# Altium schematic sheet hades_flight_controller_schematic.SchDoc (part 1 of 2)
size A1
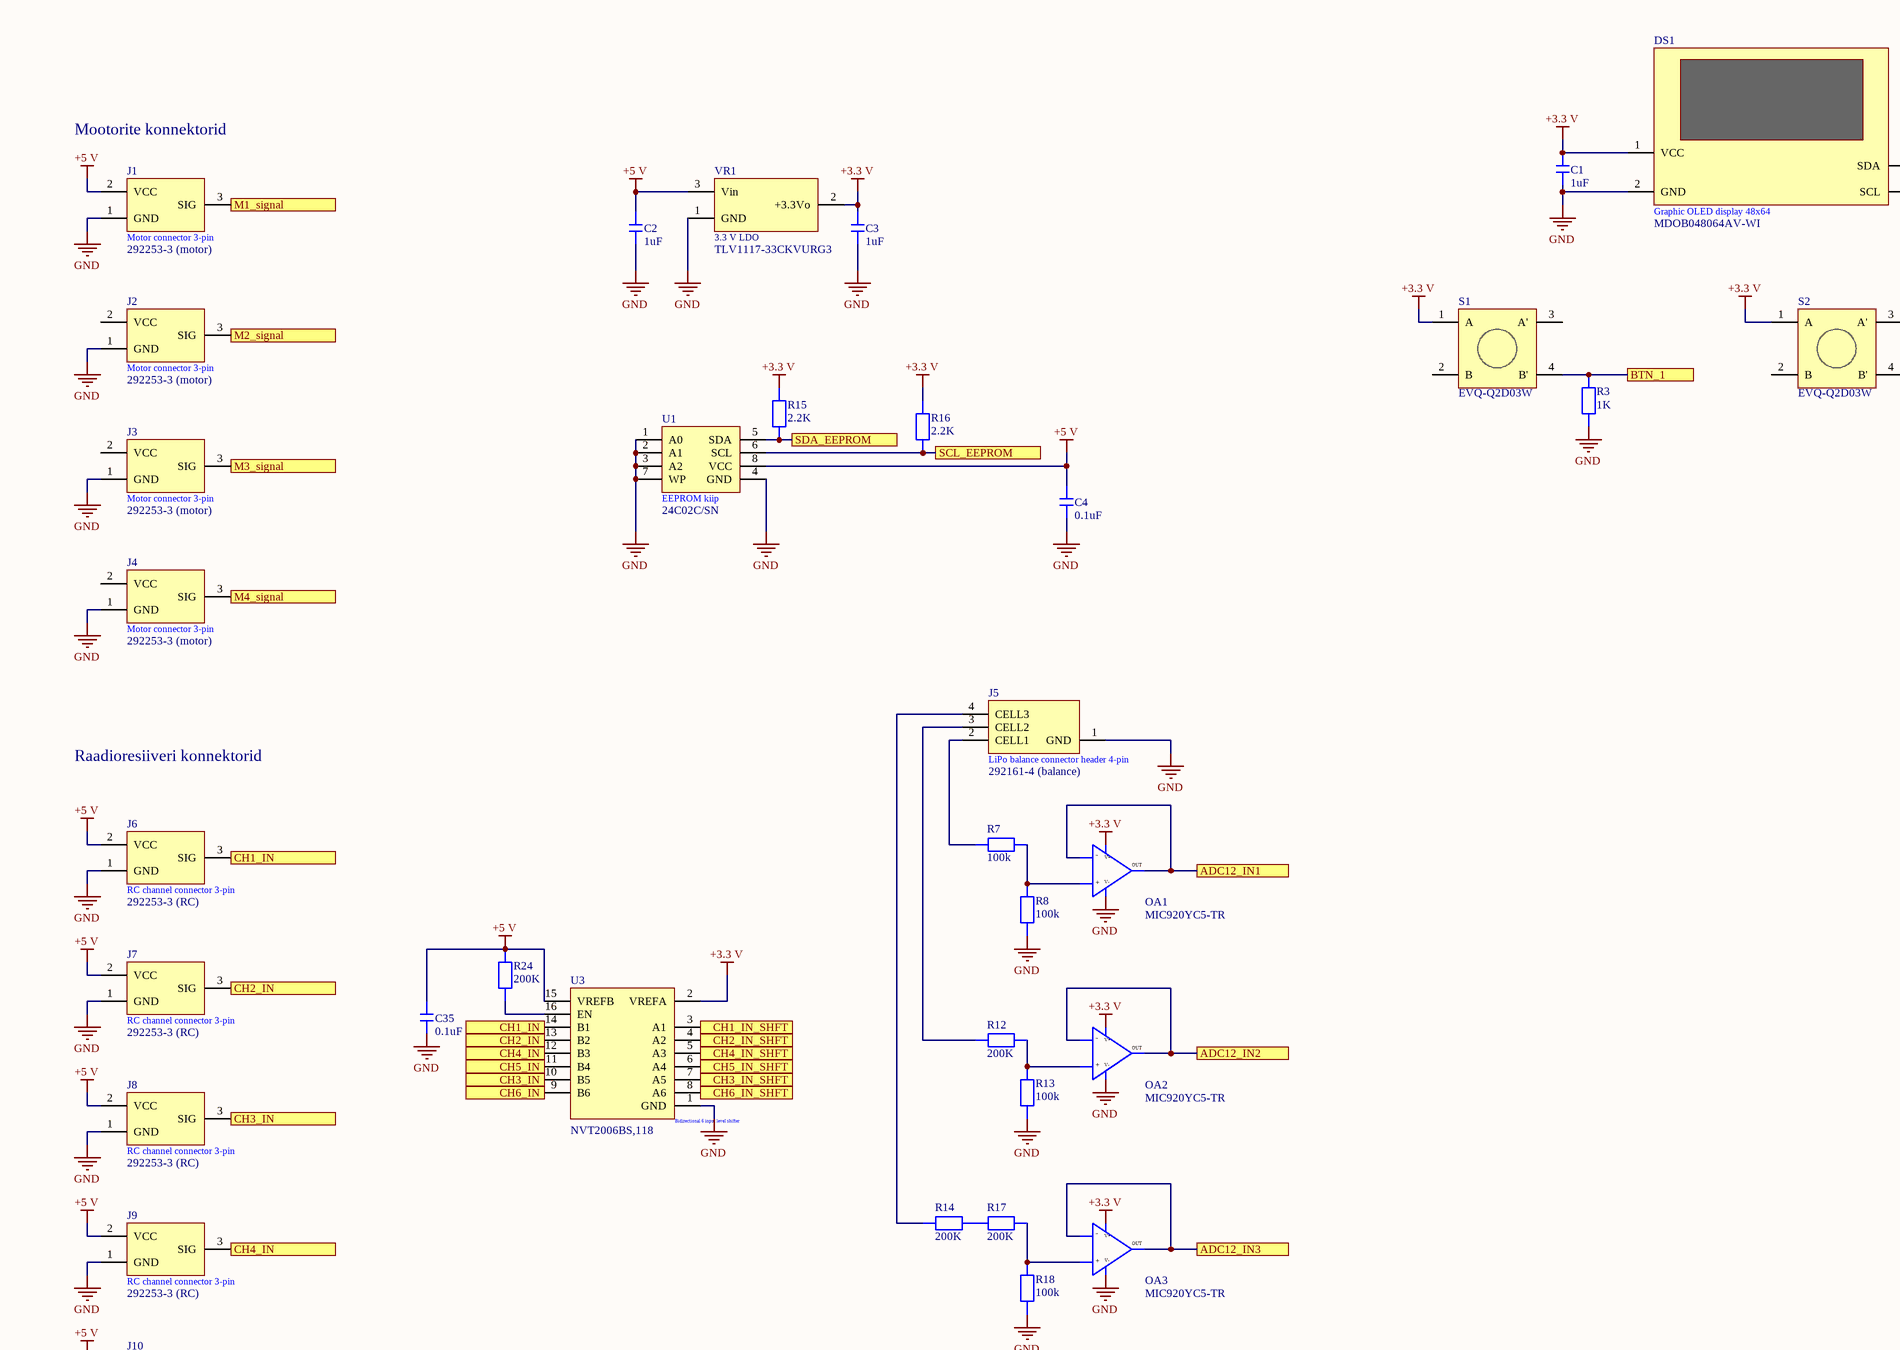
[diagram p0: hades_flight_controller_schematic.SchDoc, top left]
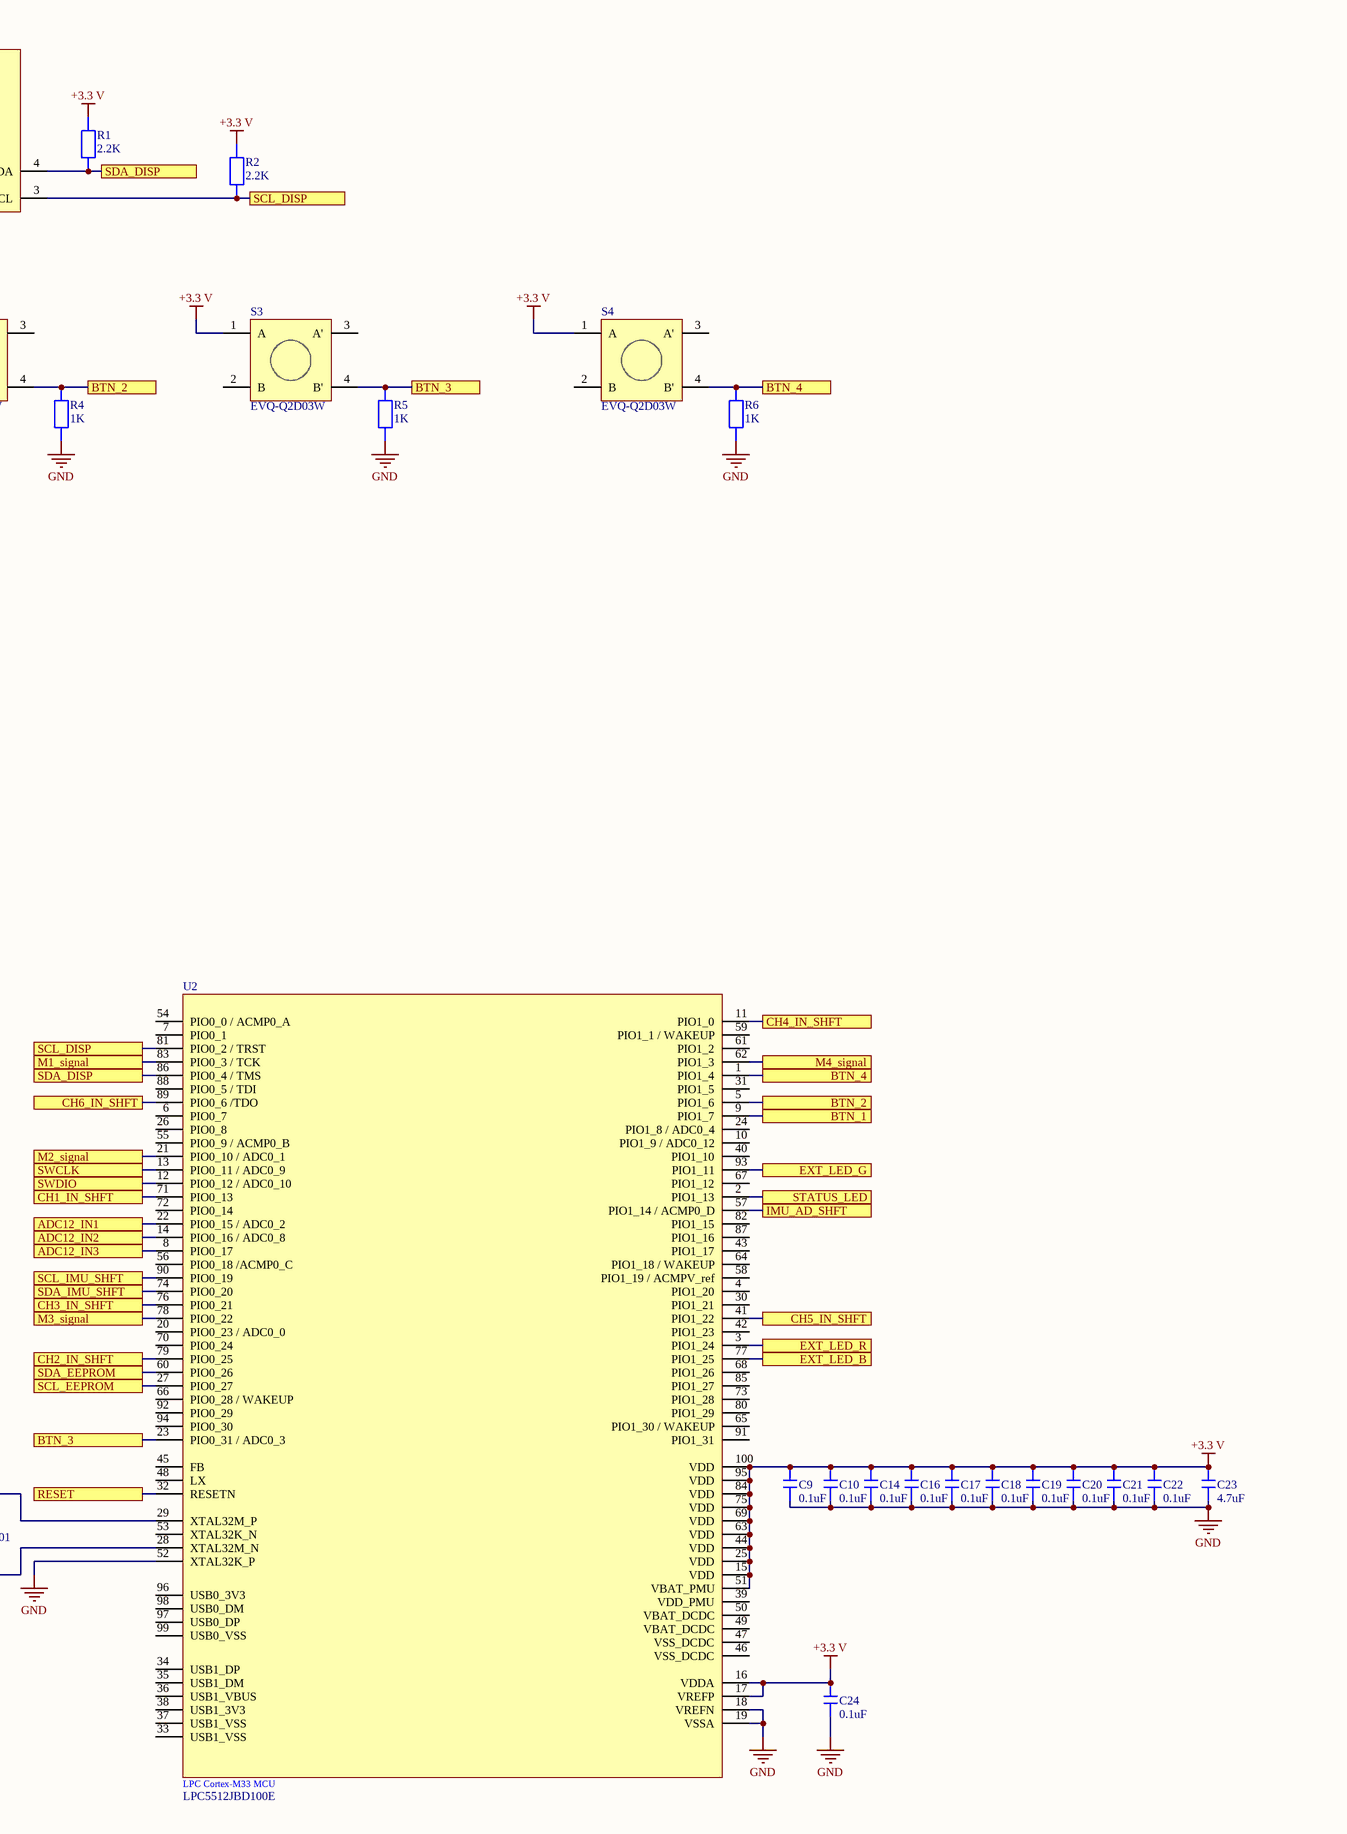
[diagram p1: hades_flight_controller_schematic.SchDoc, top right]
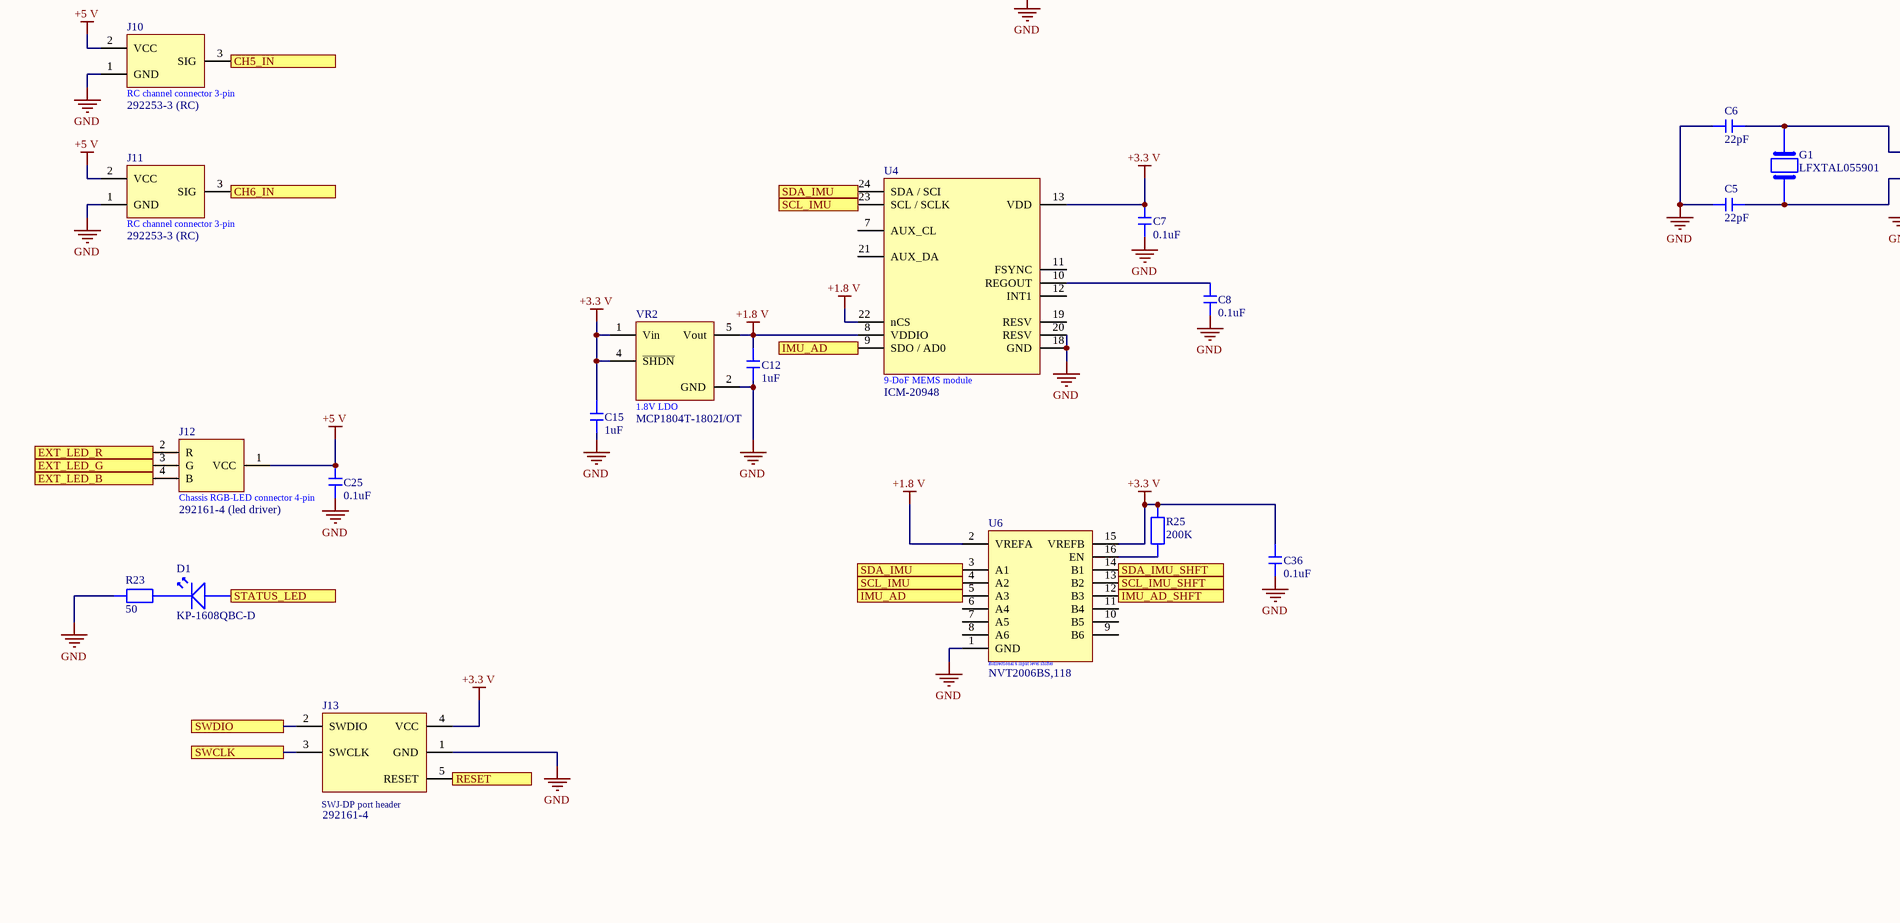
[diagram p2: hades_flight_controller_schematic.SchDoc, bottom left]
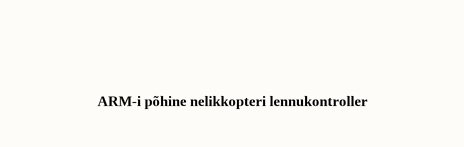
[diagram p3: hades_flight_controller_schematic.SchDoc, bottom right]

## Parts
C1  1uF  [0603 - cap]
C2  1uF  [0603 - cap]
C3  1uF  [0603 - cap]
C4  0.1uF  [0603 - cap]
C5  22pF  [0603 - cap]
C6  22pF  [0603 - cap]
C7  0.1uF  [0603 - cap]
C8  0.1uF  [0603 - cap]
C9  0.1uF  [0603 - cap]
C10  0.1uF  [0603 - cap]
C12  1uF  [0603 - cap]
C14  0.1uF  [0603 - cap]
C15  1uF  [0603 - cap]
C16  0.1uF  [0603 - cap]
C17  0.1uF  [0603 - cap]
C18  0.1uF  [0603 - cap]
C19  0.1uF  [0603 - cap]
C20  0.1uF  [0603 - cap]
C21  0.1uF  [0603 - cap]
C22  0.1uF  [0603 - cap]
C23  4.7uF  [0805 - cap]
C24  0.1uF  [0603 - cap]
C25  0.1uF  [0603 - cap]
C35  0.1uF  [0603 - cap]
C36  0.1uF  [0603 - cap]
D1  KP-1608QBC-D  [0603 - resistor]
DS1  MDOB048064AV-WI  [oled-display]
G1  LFXTAL055901  [kristall]
J1  292253-3 (motor)  [3-pin connector]
J2  292253-3 (motor)  [3-pin connector]
J3  292253-3 (motor)  [3-pin connector]
J4  292253-3 (motor)  [3-pin connector]
J5  292161-4 (balance)  [4-pin connector]
J6  292253-3 (RC)  [3-pin connector]
J7  292253-3 (RC)  [3-pin connector]
J8  292253-3 (RC)  [3-pin connector]
J9  292253-3 (RC)  [3-pin connector]
J10  292253-3 (RC)  [3-pin connector]
J11  292253-3 (RC)  [3-pin connector]
J12  292161-4 (led driver)  [4-pin connector]
J13  292161-4  [6-PIN CONNECTOR]
OA1  MIC920YC5-TR  [(OPAMP)SOT65P280X110-5N]
OA2  MIC920YC5-TR  [(OPAMP)SOT65P280X110-5N]
OA3  MIC920YC5-TR  [(OPAMP)SOT65P280X110-5N]
R1  2.2K  [0603 - resistor]
R2  2.2K  [0603 - resistor]
R3  1K  [0603 - resistor]
R4  1K  [0603 - resistor]
R5  1K  [0603 - resistor]
R6  1K  [0603 - resistor]
R7  100k  [0603 - resistor]
R8  100k  [0603 - resistor]
R12  200K  [0603 - resistor]
R13  100k  [0603 - resistor]
R14  200K  [0603 - resistor]
R15  2.2K  [0603 - resistor]
R16  2.2K  [0603 - resistor]
R17  200K  [0603 - resistor]
R18  100k  [0603 - resistor]
R23  50  [0402 - resistor]
R24  200K  [0603 - resistor]
R25  200K  [0603 - resistor]
S1  EVQ-Q2D03W  [button]
S2  EVQ-Q2D03W  [button]
S3  EVQ-Q2D03W  [button]
S4  EVQ-Q2D03W  [button]
U1  24C02C/SN  [(EEPROM)SOIC127P600X175-8N]
U2  LPC5512JBD100E  [TSQFP50P1600X1600X160_HS-101N]
U3  NVT2006BS,118  [QFN5(SHIFTER) 0P300X300X100_HS-17N]
U4  ICM-20948  [QFN40P300X300X105-24N]
U6  NVT2006BS,118  [QFN5(SHIFTER) 0P300X300X100_HS-17N]
VR1  TLV1117-33CKVURG3  [DPAK229P991X252-3N]
VR2  MCP1804T-1802I/OT  [(LDO 1.8)SOT95P270X145-5N]

## Ports
ADC12_IN1, ADC12_IN2, ADC12_IN3, BTN_1, BTN_2, BTN_3, BTN_4, CH1_IN, CH1_IN_SHFT, CH2_IN, CH2_IN_SHFT, CH3_IN, CH3_IN_SHFT, CH4_IN, CH4_IN_SHFT, CH5_IN, CH5_IN_SHFT, CH6_IN, CH6_IN_SHFT, EXT_LED_B, EXT_LED_G, EXT_LED_R, IMU_AD, IMU_AD_SHFT, M1_signal, M2_signal, M3_signal, M4_signal, RESET, SCL_DISP, SCL_EEPROM, SCL_IMU, SCL_IMU_SHFT, SDA_DISP, SDA_EEPROM, SDA_IMU, SDA_IMU_SHFT, STATUS_LED, SWCLK, SWDIO

## Nets
+1.8 V: C12.1 U4.8(VDDIO) U4.22(nCS) U6.2(VREFA) VR2.5(Vout)
+3.3 V: C1.1 C3.1 C7.1 C9.1 C10.1 C14.1 C15.1 C16.1 C17.1 C18.1 C19.1 C20.1 C21.1 C22.1 C23.1 C24.1 C36.1 DS1.1(VCC) J13.4(VCC) OA1.5(V+) OA2.5(V+) OA3.5(V+) R1.1 R2.1 R15.1 R16.1 R25.1 S1.1(A) S2.1(A) S3.1(A) S4.1(A) U2.15(VDD) U2.16(VDDA) U2.17(VREFP) U2.25(VDD) U2.44(VDD) U2.51(VBAT_PMU) U2.63(VDD) U2.69(VDD) U2.75(VDD) U2.84(VDD) U2.95(VDD) U2.100(VDD) U3.2(VREFA) U4.13(VDD) U6.15(VREFB) VR1.2(+3.3Vo) VR2.1(Vin) VR2.4(~{SHDN})
+5 V: C2.1 C4.1 C25.1 C35.1 J1.2(VCC) J6.2(VCC) J7.2(VCC) J8.2(VCC) J9.2(VCC) J10.2(VCC) J11.2(VCC) J12.1(VCC) R24.1 U1.8(VCC) U3.15(VREFB) VR1.3(Vin)
GND: C1.2 C2.2 C3.2 C4.2 C5.1 C6.1 C7.2 C8.2 C9.2 C10.2 C12.2 C14.2 C15.2 C16.2 C17.2 C18.2 C19.2 C20.2 C21.2 C22.2 C23.2 C24.2 C25.2 C35.2 C36.2 DS1.2(GND) J1.1(GND) J2.1(GND) J3.1(GND) J4.1(GND) J5.1(GND) J6.1(GND) J7.1(GND) J8.1(GND) J9.1(GND) J10.1(GND) J11.1(GND) J13.1(GND) OA1.2(V-) OA2.2(V-) OA3.2(V-) R3.2 R4.2 R5.2 R6.2 R8.2 R13.2 R18.2 R23.2 U1.1(A0) U1.2(A1) U1.3(A2) U1.4(GND) U1.7(WP) U2.18(VREFN) U2.19(VSSA) U2.52(XTAL32K_P) U3.1(GND) U4.18(GND) U4.20(RESV) U6.1(GND) VR1.1(GND) VR2.2(GND)
ADC12_IN1: OA1.3(-) OA1.4(OUT) U2.22(PIO0_15_/_ADC0_2) ; port ADC12_IN1
ADC12_IN2: OA2.3(-) OA2.4(OUT) U2.14(PIO0_16_/_ADC0_8) ; port ADC12_IN2
ADC12_IN3: OA3.3(-) OA3.4(OUT) U2.8(PIO0_17) ; port ADC12_IN3
BTN_1: R3.1 S1.4(B') U2.9(PIO1_7) ; port BTN_1
BTN_2: R4.1 S2.4(B') U2.5(PIO1_6) ; port BTN_2
BTN_3: R5.1 S3.4(B') U2.23(PIO0_31_/_ADC0_3) ; port BTN_3
BTN_4: R6.1 S4.4(B') U2.1(PIO1_4) ; port BTN_4
CH1_IN: J6.3(SIG) U3.14(B1) ; port CH1_IN
CH1_IN_SHFT: U2.71(PIO0_13) U3.3(A1) ; port CH1_IN_SHFT
CH2_IN: J7.3(SIG) U3.13(B2) ; port CH2_IN
CH2_IN_SHFT: U2.79(PIO0_25) U3.4(A2) ; port CH2_IN_SHFT
CH3_IN: J8.3(SIG) U3.10(B5) ; port CH3_IN
CH3_IN_SHFT: U2.76(PIO0_21) U3.7(A5) ; port CH3_IN_SHFT
CH4_IN: J9.3(SIG) U3.12(B3) ; port CH4_IN
CH4_IN_SHFT: U2.11(PIO1_0) U3.5(A3) ; port CH4_IN_SHFT
CH5_IN: J10.3(SIG) U3.11(B4) ; port CH5_IN
CH5_IN_SHFT: U2.41(PIO1_22) U3.6(A4) ; port CH5_IN_SHFT
CH6_IN: J11.3(SIG) U3.9(B6) ; port CH6_IN
CH6_IN_SHFT: U2.89(PIO0_6_/TDO) U3.8(A6) ; port CH6_IN_SHFT
EXT_LED_B: J12.4(B) U2.77(PIO1_25) ; port EXT_LED_B
EXT_LED_G: J12.3(G) U2.93(PIO1_11) ; port EXT_LED_G
EXT_LED_R: J12.2(R) U2.3(PIO1_24) ; port EXT_LED_R
IMU_AD: U4.9(SDO_/_AD0) U6.5(A3) ; port IMU_AD
IMU_AD_SHFT: U2.57(PIO1_14_/_ACMP0_D) U6.12(B3) ; port IMU_AD_SHFT
M1_signal: J1.3(SIG) U2.83(PIO0_3_/_TCK) ; port M1_signal
M2_signal: J2.3(SIG) U2.21(PIO0_10_/_ADC0_1) ; port M2_signal
M3_signal: J3.3(SIG) U2.78(PIO0_22) ; port M3_signal
M4_signal: J4.3(SIG) U2.62(PIO1_3) ; port M4_signal
RESET: J13.5(RESET) U2.32(RESETN) ; port RESET
SCL_DISP: DS1.3(SCL) R2.2 U2.81(PIO0_2_/_TRST) ; port SCL_DISP
SCL_EEPROM: R16.2 U1.6(SCL) U2.27(PIO0_27) ; port SCL_EEPROM
SCL_IMU: U4.23(SCL_/_SCLK) U6.4(A2) ; port SCL_IMU
SCL_IMU_SHFT: U2.90(PIO0_19) U6.13(B2) ; port SCL_IMU_SHFT
SDA_DISP: DS1.4(SDA) R1.2 U2.86(PIO0_4_/_TMS) ; port SDA_DISP
SDA_EEPROM: R15.2 U1.5(SDA) U2.60(PIO0_26) ; port SDA_EEPROM
SDA_IMU: U4.24(SDA_/_SCI) U6.3(A1) ; port SDA_IMU
SDA_IMU_SHFT: U2.74(PIO0_20) U6.14(B1) ; port SDA_IMU_SHFT
STATUS_LED: D1.1 U2.2(PIO1_13) ; port STATUS_LED
SWCLK: J13.3(SWCLK) U2.13(PIO0_11_/_ADC0_9) ; port SWCLK
SWDIO: J13.2(SWDIO) U2.12(PIO0_12_/_ADC0_10) ; port SWDIO
NetC5_2: C5.2 G1.4 U2.28(XTAL32M_N)
NetC6_2: C6.2 G1.3 U2.29(XTAL32M_P)
NetC8_1: C8.1 U4.10(REGOUT)
NetD1_2: D1.2 R23.1
NetJ5_2: J5.2(CELL1) R7.1
NetJ5_3: J5.3(CELL2) R12.2
NetJ5_4: J5.4(CELL3) R14.2
NetOA1_1: OA1.1(+) R7.2 R8.1
NetOA2_1: OA2.1(+) R12.1 R13.1
NetOA3_1: OA3.1(+) R17.1 R18.1
NetR14_1: R14.1 R17.2
NetR24_2: R24.2 U3.16(EN)
NetR25_2: R25.2 U6.16(EN)

Not connected (* = marked no-connect by the designer): J2 2(VCC); J3 2(VCC); J4 2(VCC); S1 2(B) 3(A'); S2 2(B) 3(A'); S3 2(B) 3(A'); S4 2(B) 3(A'); U2 4(PIO1_20) 6(PIO0_7) 7(PIO0_1) 10(PIO1_9_/_ADC0_12) 20(PIO0_23_/_ADC0_0) 24(PIO1_8_/_ADC0_4) 26(PIO0_8) 30(PIO1_21) 31(PIO1_5) 33(USB1_VSS) 34(USB1_DP) 35(USB1_DM) 36(USB1_VBUS) 37(USB1_VSS) 38(USB1_3V3) 39(VDD_PMU) 40(PIO1_10) 42(PIO1_23) 43(PIO1_17) 45(FB) 46(VSS_DCDC) 47(VSS_DCDC) 48(LX) 49(VBAT_DCDC) 50(VBAT_DCDC) 53(XTAL32K_N) 54(PIO0_0_/_ACMP0_A) 55(PIO0_9_/_ACMP0_B) 56(PIO0_18_/ACMP0_C) 58(PIO1_19_/_ACMPV_ref) 59(PIO1_1_/_WAKEUP) 61(PIO1_2) 64(PIO1_18_/_WAKEUP) 65(PIO1_30_/_WAKEUP) 66(PIO0_28_/_WAKEUP) 67(PIO1_12) 68(PIO1_26) 70(PIO0_24) 72(PIO0_14) 73(PIO1_28) 80(PIO1_29) 82(PIO1_15) 85(PIO1_27) 87(PIO1_16) 88(PIO0_5_/_TDI) 91(PIO1_31) 92(PIO0_29) 94(PIO0_30) 96(USB0_3V3) 97(USB0_DP) 98(USB0_DM) 99(USB0_VSS); U4 7(AUX_CL) 11(FSYNC) 12(INT1) 19(RESV) 21(AUX_DA); U6 6(A4) 7(A5) 8(A6) 9(B6) 10(B5) 11(B4)

## Notes on the sheet
- Mootorite konnektorid
- Raadioresiiveri konnektorid
- ARM-i põhine nelikkopteri lennukontroller
- Title
- Size:
- Date:
- File:
- A1
- Number:
- Time:
- Revision:
- Sheet
- of
- (in symbol 24C02C/SN) EEPROM kiip
- (in symbol 292161-4) SWJ-DP port header
- (in symbol 292161-4 (balance)) LiPo balance connector header 4-pin
- (in symbol 292161-4 (led driver)) Chassis RGB-LED connector 4-pin
- (in symbol 292253-3 (motor)) Motor connector 3-pin
- (in symbol 292253-3 (RC)) RC channel connector 3-pin
- (in symbol ICM-20948) 9-DoF MEMS module
- (in symbol LPC5512JBD100E) LPC Cortex-M33 MCU
- (in symbol MCP1804T-1802I/OT) 1.8V LDO
- (in symbol MDOB048064AV-WI) Graphic OLED display 48x64
- (in symbol NVT2006BS,118) Bidirectional 6 input level shifter
- (in symbol TLV1117-33CKVURG3) 3.3 V LDO